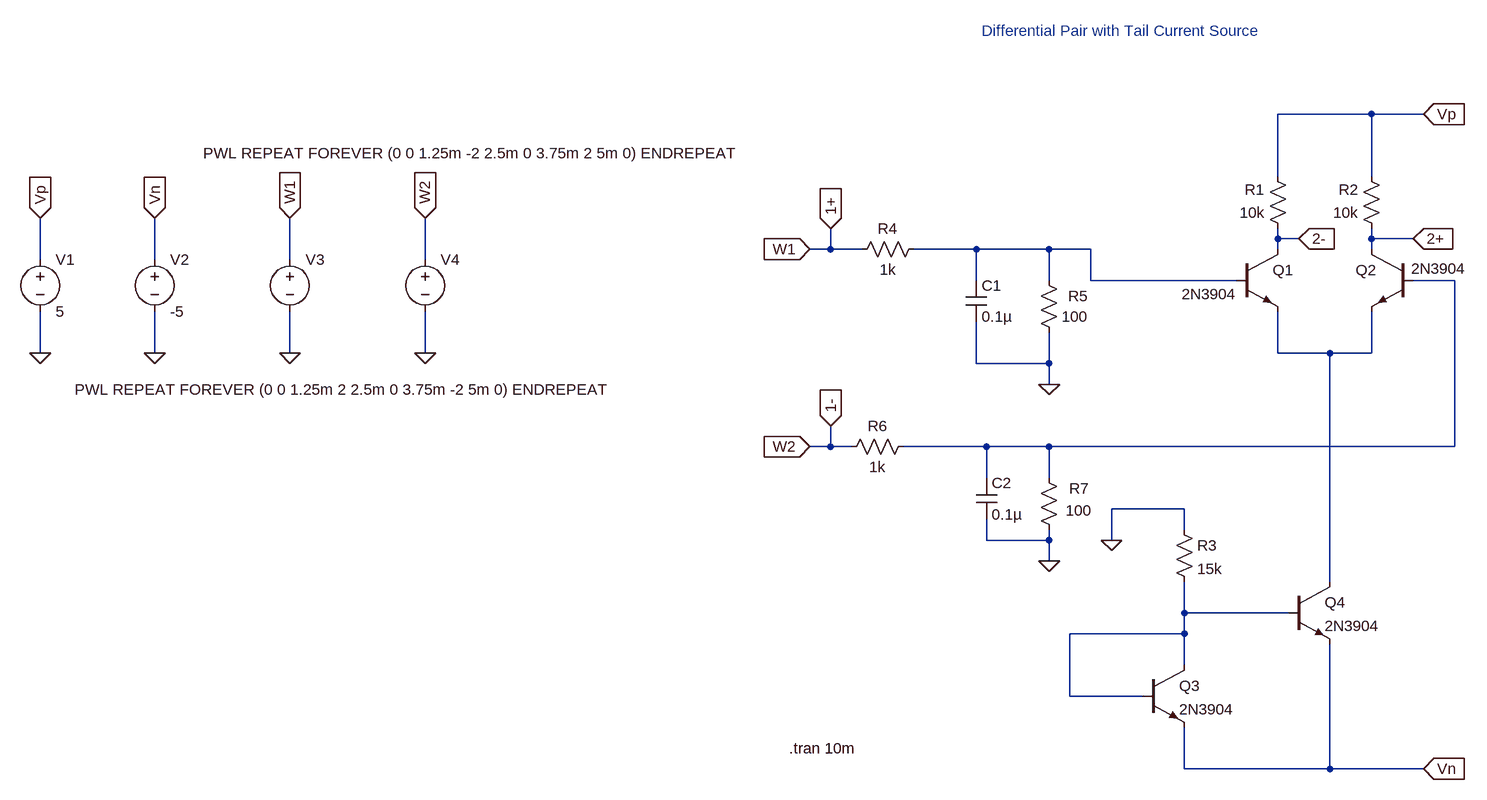
[diagram p0: schematic diff_pair_tail_cs_ltspice.asc]
diff_pair_tail_cs_ltspice.asc, the LTspice schematic file:
Version 4
SHEET 1 1032 872
WIRE 864 -208 720 -208
WIRE 944 -208 864 -208
WIRE 720 -112 720 -208
WIRE 864 -112 864 -208
WIRE 720 -16 720 -32
WIRE 752 -16 720 -16
WIRE 864 -16 864 -32
WIRE 928 -16 864 -16
WIRE 32 0 32 -32
WIRE 32 0 0 0
WIRE 80 0 32 0
WIRE 256 0 160 0
WIRE 368 0 256 0
WIRE 432 0 368 0
WIRE 720 0 720 -16
WIRE 864 0 864 -16
WIRE -1184 16 -1184 -48
WIRE -1008 16 -1008 -48
WIRE -800 16 -800 -48
WIRE -592 16 -592 -48
WIRE 256 48 256 0
WIRE 368 48 368 0
WIRE 432 48 432 0
WIRE 656 48 432 48
WIRE 992 48 928 48
WIRE -1184 160 -1184 96
WIRE -1008 160 -1008 96
WIRE -800 160 -800 96
WIRE -592 160 -592 96
WIRE 720 160 720 96
WIRE 800 160 720 160
WIRE 864 160 864 96
WIRE 864 160 800 160
WIRE 256 176 256 112
WIRE 368 176 368 128
WIRE 368 176 256 176
WIRE 368 208 368 176
WIRE 32 304 32 272
WIRE 32 304 0 304
WIRE 64 304 32 304
WIRE 272 304 144 304
WIRE 368 304 272 304
WIRE 992 304 992 48
WIRE 992 304 368 304
WIRE 272 352 272 304
WIRE 368 352 368 304
WIRE 576 400 464 400
WIRE 576 432 576 400
WIRE 272 448 272 416
WIRE 368 448 368 432
WIRE 368 448 272 448
WIRE 464 448 464 400
WIRE 368 480 368 448
WIRE 800 512 800 160
WIRE 576 560 576 512
WIRE 736 560 576 560
WIRE 576 592 576 560
WIRE 576 592 400 592
WIRE 576 640 576 592
WIRE 400 688 400 592
WIRE 512 688 400 688
WIRE 576 800 576 736
WIRE 800 800 800 608
WIRE 800 800 576 800
WIRE 944 800 800 800
FLAG 368 208 0
FLAG 368 480 0
FLAG 944 -208 Vp
IOPIN 944 -208 In
FLAG 0 0 W1
IOPIN 0 0 In
FLAG 0 304 W2
IOPIN 0 304 In
FLAG -1184 160 0
FLAG -1008 160 0
FLAG -800 160 0
FLAG -592 160 0
FLAG -1184 -48 Vp
IOPIN -1184 -48 In
FLAG -1008 -48 Vn
IOPIN -1008 -48 In
FLAG -800 -48 W1
IOPIN -800 -48 In
FLAG -592 -48 W2
IOPIN -592 -48 In
FLAG 928 -16 2+
IOPIN 928 -16 In
FLAG 944 800 Vn
IOPIN 944 800 In
FLAG 464 448 0
FLAG 32 -32 1+
IOPIN 32 -32 In
FLAG 32 272 1-
IOPIN 32 272 In
FLAG 752 -16 2-
IOPIN 752 -16 In
SYMBOL res 736 -16 R180
WINDOW 0 36 76 Left 2
WINDOW 3 36 40 Left 2
SYMATTR InstName R1
SYMATTR Value 10k
SYMBOL res 880 -16 R180
WINDOW 0 36 76 Left 2
WINDOW 3 36 40 Left 2
SYMATTR InstName R2
SYMATTR Value 10k
SYMBOL res 64 16 R270
WINDOW 0 32 56 VTop 2
WINDOW 3 0 56 VBottom 2
SYMATTR InstName R4
SYMATTR Value 1k
SYMBOL res 384 144 R180
WINDOW 0 -44 72 Left 2
WINDOW 3 -44 40 Left 2
SYMATTR InstName R5
SYMATTR Value 100
SYMBOL res 48 320 R270
WINDOW 0 32 56 VTop 2
WINDOW 3 0 56 VBottom 2
SYMATTR InstName R6
SYMATTR Value 1k
SYMBOL res 384 448 R180
WINDOW 0 -46 80 Left 2
WINDOW 3 -50 46 Left 2
SYMATTR InstName R7
SYMATTR Value 100
SYMBOL npn 656 0 R0
WINDOW 3 -84 69 Left 2
SYMATTR Value 2N3904
SYMATTR InstName Q1
SYMBOL npn 928 0 M0
WINDOW 3 -82 30 Left 2
SYMATTR Value 2N3904
SYMATTR InstName Q2
SYMBOL cap 240 48 R0
SYMATTR InstName C1
SYMATTR Value 0.1µ
SYMBOL cap 256 352 R0
SYMATTR InstName C2
SYMATTR Value 0.1µ
SYMBOL voltage -1184 0 R0
WINDOW 123 0 0 Left 0
WINDOW 39 0 0 Left 0
SYMATTR InstName V1
SYMATTR Value 5
SYMBOL voltage -1008 0 R0
WINDOW 123 0 0 Left 0
WINDOW 39 0 0 Left 0
SYMATTR InstName V2
SYMATTR Value -5
SYMBOL voltage -800 0 R0
WINDOW 3 -331 216 Left 2
WINDOW 123 0 0 Left 0
WINDOW 39 0 0 Left 0
SYMATTR Value PWL REPEAT FOREVER (0 0 1.25m 2 2.5m 0 3.75m -2 5m 0) ENDREPEAT
SYMATTR InstName V3
SYMBOL voltage -592 0 R0
WINDOW 3 -341 -148 Left 2
WINDOW 123 0 0 Left 0
WINDOW 39 0 0 Left 0
SYMATTR Value PWL REPEAT FOREVER (0 0 1.25m -2 2.5m 0 3.75m 2 5m 0) ENDREPEAT
SYMATTR InstName V4
SYMBOL npn 512 640 R0
SYMATTR InstName Q3
SYMATTR Value 2N3904
SYMBOL npn 736 512 R0
SYMATTR InstName Q4
SYMATTR Value 2N3904
SYMBOL res 560 416 R0
SYMATTR InstName R3
SYMATTR Value 15k
TEXT -32 768 Left 2 !.tran 10m
TEXT 264 -336 Left 2 ;Differential Pair with Tail Current Source

The netlist it stands for:
* diff_pair_tail_cs_ltspice.asc
R1 2- Vp 10k
R2 2+ Vp 10k
R4 1+ N001 1k
R5 0 N001 100
R6 1- N002 1k
R7 0 N002 100
Q1 2- N001 N003 0 2N3904
Q2 2+ N002 N003 0 2N3904
C1 N001 0 0.1µ
C2 N002 0 0.1µ
V1 Vp 0 5
V2 Vn 0 -5
V3 1+ 0 PWL REPEAT FOREVER (0 0 1.25m 2 2.5m 0 3.75m -2 5m 0) ENDREPEAT
V4 1- 0 PWL REPEAT FOREVER (0 0 1.25m -2 2.5m 0 3.75m 2 5m 0) ENDREPEAT
Q3 N004 N004 Vn 0 2N3904
Q4 N003 N004 Vn 0 2N3904
R3 0 N004 15k
.model NPN NPN
.model PNP PNP
.lib standard.bjt
.tran 10m
* Differential Pair with Tail Current Source
.backanno
.end